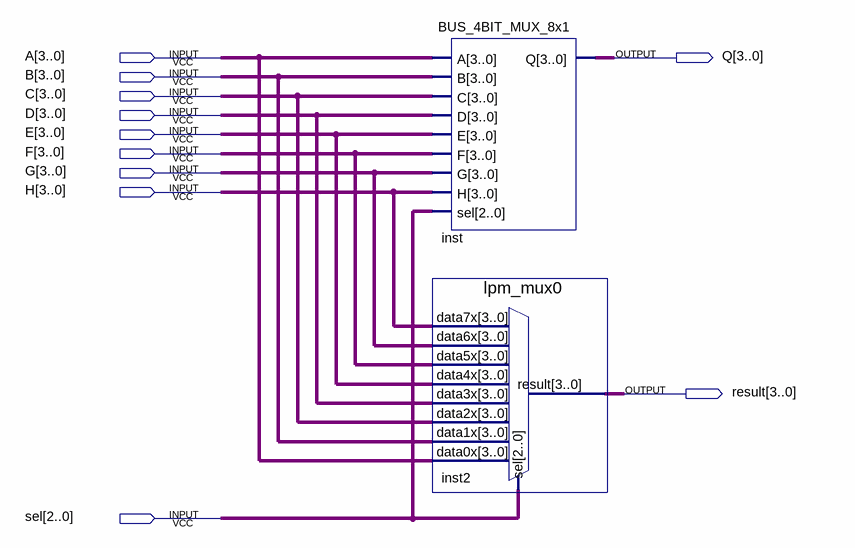
[diagram p0: schematic sheet]
// Quartus schematic BUS_MUX_COMPARE.bdf as structural Verilog: 2 symbols, 11 pins
module BUS_MUX_COMPARE (
  input  [3:0] A,
  input  [3:0] B,
  input  [3:0] C,
  input  [3:0] D,
  input  [3:0] E,
  input  [3:0] F,
  input  [3:0] G,
  input  [3:0] H,
  input  [2:0] sel,
  output [3:0] Q,
  output [3:0] result
);

  BUS_4BIT_MUX_8x1 inst (.A(A), .B(B), .C(C), .D(D), .E(E), .F(F), .G(G), .H(H), .sel(sel), .Q(Q));
  lpm_mux0 inst2 (
    .data7x(H), .data6x(G), .data5x(F), .data4x(E), .data3x(D), .data2x(C), .data1x(B), .data0x(A),
    .sel(sel), .result(result));
endmodule
